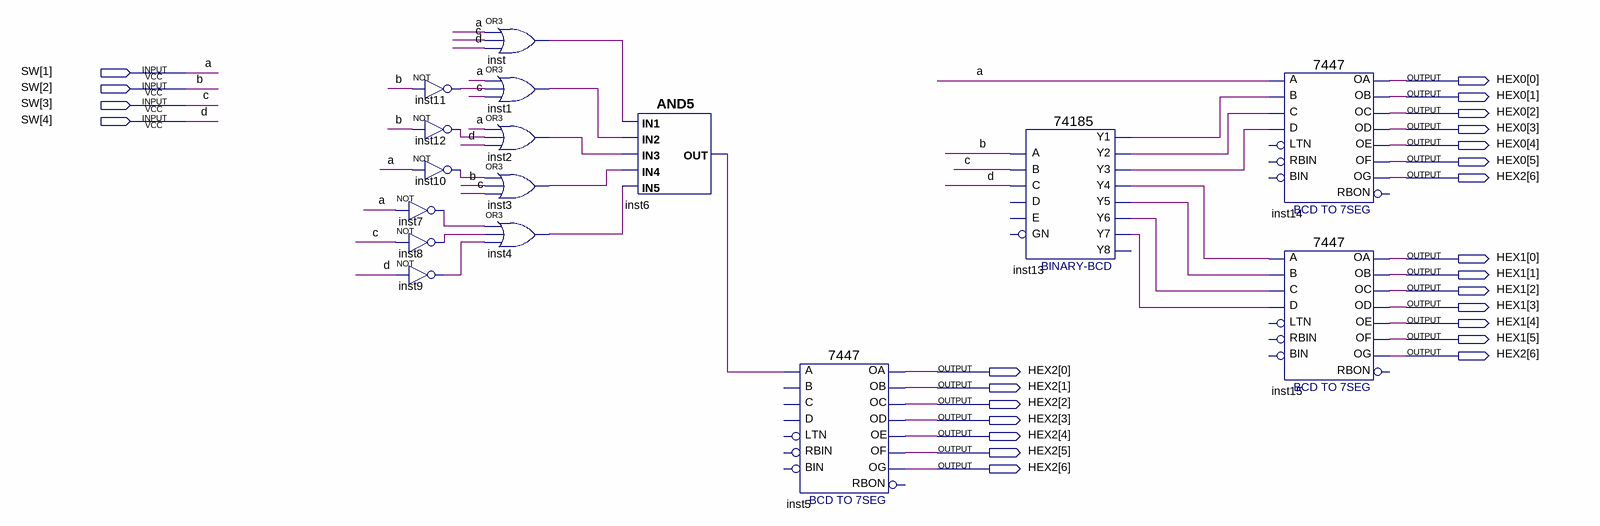
[diagram p0: schematic sheet]
// Quartus schematic zad2.bdf as structural Verilog: 16 symbols, 25 pins
module zad2 (
  input  [4:1] SW,
  output [5:0] HEX0,
  output [6:0] HEX2,
  output [5:0] HEX1
);

  wire inst1_out, inst2_out, inst3_out, inst4_out, inst6_out, inst7_out, inst8_out, inst9_out, inst10_out,
       inst11_out, inst12_out, inst13_y1, inst13_y2, inst13_y3, inst13_y4, inst13_y5, inst13_y6, inst13_y7,
       inst_out;

  not inst7 (inst7_out, SW[1]);
  not inst8 (inst8_out, SW[3]);
  not inst9 (inst9_out, SW[4]);
  not inst11 (inst11_out, SW[2]);
  not inst12 (inst12_out, SW[2]);
  not inst10 (inst10_out, SW[1]);
  or inst (inst_out, SW[1], SW[3], SW[4]);
  or inst1 (inst1_out, SW[1], inst11_out, SW[3]);
  or inst2 (inst2_out, SW[1], inst12_out, SW[4]);
  or inst3 (inst3_out, inst10_out, SW[2], SW[3]);
  or inst4 (inst4_out, inst7_out, inst8_out, inst9_out);
  and inst6 (inst6_out, inst_out, inst1_out, inst2_out, inst3_out, inst4_out);
  \7447  inst5 (
    .A(inst6_out), .OB(HEX2[1]), .OC(HEX2[2]), .OE(HEX2[4]), .OD(HEX2[3]), .OF(HEX2[5]), .OG(HEX2[6]),
    .OA(HEX2[0]));  // open: LTN, B, C, D, RBIN, BIN, RBON
  \74185  inst13 (
    .A(SW[2]), .B(SW[3]), .C(SW[4]), .Y1(inst13_y1), .Y3(inst13_y3), .Y2(inst13_y2), .Y5(inst13_y5),
    .Y4(inst13_y4), .Y6(inst13_y6), .Y7(inst13_y7));  // open: D, E, GN, Y8
  \7447  inst14 (
    .B(inst13_y1), .C(inst13_y2), .D(inst13_y3), .A(SW[1]), .OB(HEX0[1]), .OC(HEX0[2]), .OE(HEX0[4]),
    .OD(HEX0[3]), .OF(HEX0[5]), .OG(HEX2[6]), .OA(HEX0[0]));  // open: LTN, RBIN, BIN, RBON
  \7447  inst15 (
    .B(inst13_y5), .C(inst13_y6), .D(inst13_y7), .A(inst13_y4), .OB(HEX1[1]), .OC(HEX1[2]), .OE(HEX1[4]),
    .OD(HEX1[3]), .OF(HEX1[5]), .OG(HEX2[6]), .OA(HEX1[0]));  // open: LTN, RBIN, BIN, RBON

  // Other names for the same wires on the sheet: a = SW[1]; b = SW[2]; c = SW[3]; d = SW[4]
endmodule
